# EAGLE schematic Nixie (EAGLE 9.1.3)
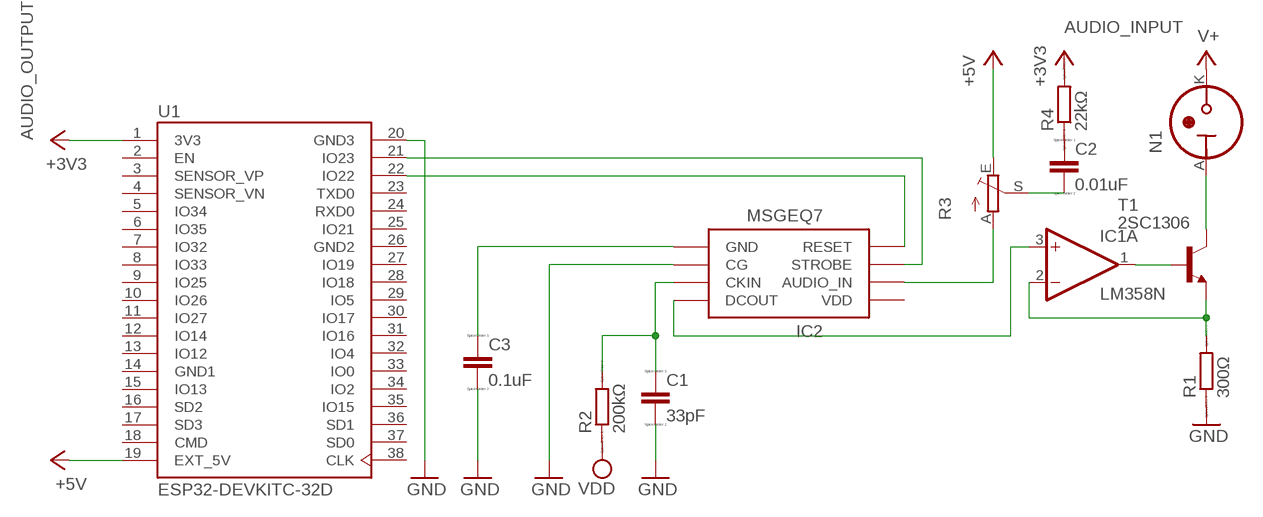
[diagram p0: schematic, sheet 1]

## Parts
C1  33pF  C  [C0805]
C2  0.01uF  C  [C0805]
C3  0.1uF  C  [C0805]
IC1  LM358N  [DIL08]
IC2  MSGEQ7DIL  [DIL-08]
N1  IN-9  [IN-9]
R1  300Ω  R  [R0805]
R2  200kΩ  R  [R0805]
R3  TRIM_EU-B25P  [B25P]
R4  22kΩ  R  [R0805]
T1  2SC1306  [TO220BV]
U1  ESP32-DEVKITC-32D  [MODULE_ESP32-DEVKITC-32D]

## Nets
+3V3: R4.2 U1.1(3V3)
+5V: R3.E U1.19(EXT_5V)
GND: C1.2 C3.2 IC2.6(CG) R1.1 U1.20(GND3)
N$1: IC1.2(A:-IN) R1.2 T1.3(E)
N$2: IC2.5(AUDIO_IN) R3.A
N$3: IC1.1(A:OUT) T1.1(B)
N$4: N1.A T1.2(C)
N$5: C2.2 R3.S
N$6: C1.1 IC2.8(CKIN) R2.2
N$7: C2.1 R4.1
N$8: IC1.3(A:+IN) IC2.3(DCOUT)
N$9: C3.1 IC2.2(GND)
N$10: IC2.4(STROBE) U1.21(IO23)
N$11: IC2.7(RESET) U1.22(IO22)
V+: N1.K
VDD: R2.1
Unconnected: IC1.5(B:+IN) IC1.6(B:-IN) IC1.7(B:OUT) IC2.1(VDD) U1.2(EN) U1.3(SENSOR_VP) U1.4(SENSOR_VN) U1.5(IO34) U1.6(IO35) U1.7(IO32) U1.8(IO33) U1.9(IO25) U1.10(IO26) U1.11(IO27) U1.12(IO14) U1.13(IO12) U1.15(IO13) U1.16(SD2) U1.17(SD3) U1.18(CMD) U1.23(TXD0) U1.24(RXD0) U1.25(IO21) U1.27(IO19) U1.28(IO18) U1.29(IO5) U1.30(IO17) U1.31(IO16) U1.32(IO4) U1.33(IO0) U1.34(IO2) U1.35(IO15) U1.36(SD1) U1.37(SD0) U1.38(CLK)

## Power pins joined to a net without a drawn wire
GND1: U1.14(GND1)
GND2: U1.26(GND2)
V+: IC1.8(P:V+)
V-: IC1.4(P:V-)

## Library data of the parts
C1-C3 = eagle-ltspice:C: CAPACITOR, European symbol; SPICEMODEL: NONE; SPICEPREFIX: C
IC1 = linear:LM358: OP AMP also LM158; LM258; LM2904 Source: http://cache.national.com/ds/LM/LM158.pdf
IC2 = MSGEQ7:MSGEQ7: 7-band graphic equalizer; AVAILABILITY: Unavailable; DESCRIPTION: Seven Band Graphic Equalizer Display Filter; MF: Mixed Signal Integration; MP: MSGEQ7; PACKAGE: SOIC-8 Mixed Signal Integration; PRICE: None
N1 = russian-nixies:IN-9: IN-9: nixie bargraph
R1 R2 R4 = eagle-ltspice:R: RESISTOR, European symbol; SPICEMODEL: NONE; SPICEPREFIX: R
R3 = 161104 Library by matsu:TRIM_EU-: POTENTIOMETER
T1 = transistor-neu-to92:2SC1306: NPN Transistor Final RF Power Outupt Source: 2sc1306.pdf
U1 = ESP32-DEVKITC-32D:ESP32-DEVKITC-32D: Eval Board For Esp-Wroom-32; AVAILABILITY: Unavailable; DESCRIPTION: Eval Board For Esp-Wroom-32; MF: Espressif Systems; MP: ESP32-DEVKITC-32D; PACKAGE: None; PRICE: None